# EAGLE design open-lux-Q (EAGLE 6.5.0)
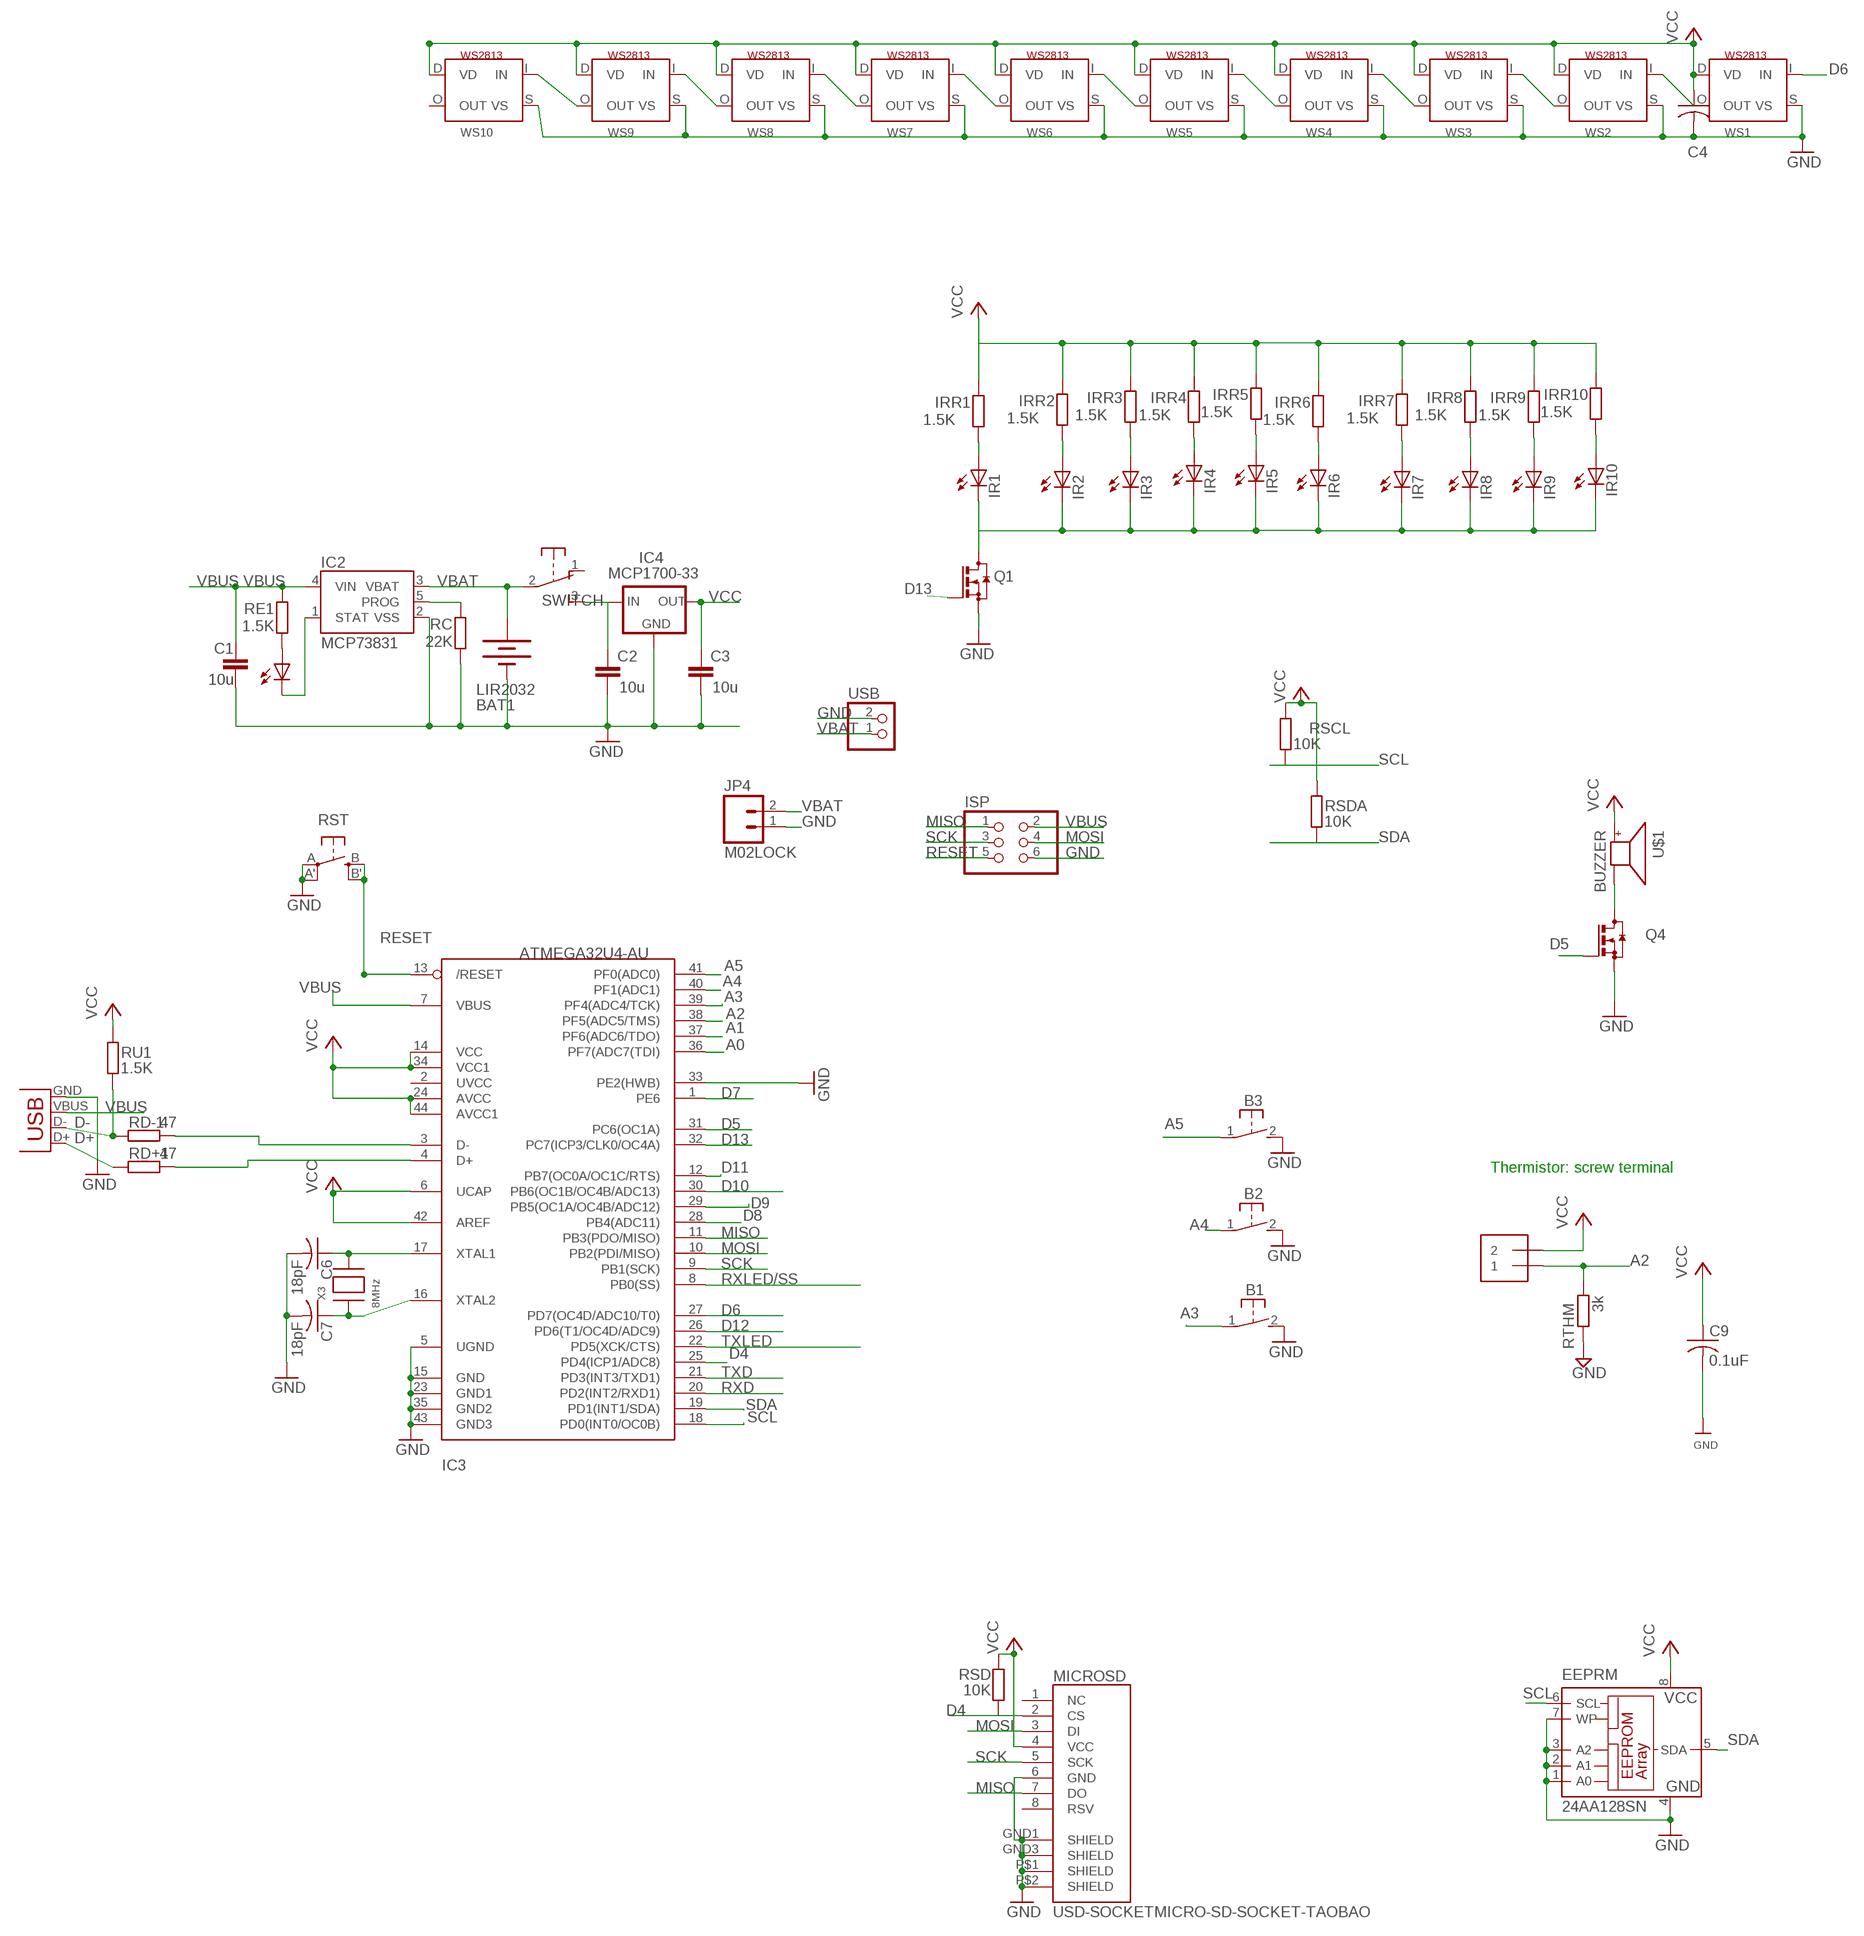
[diagram p0: schematic, sheet 1, part 1 of 2]
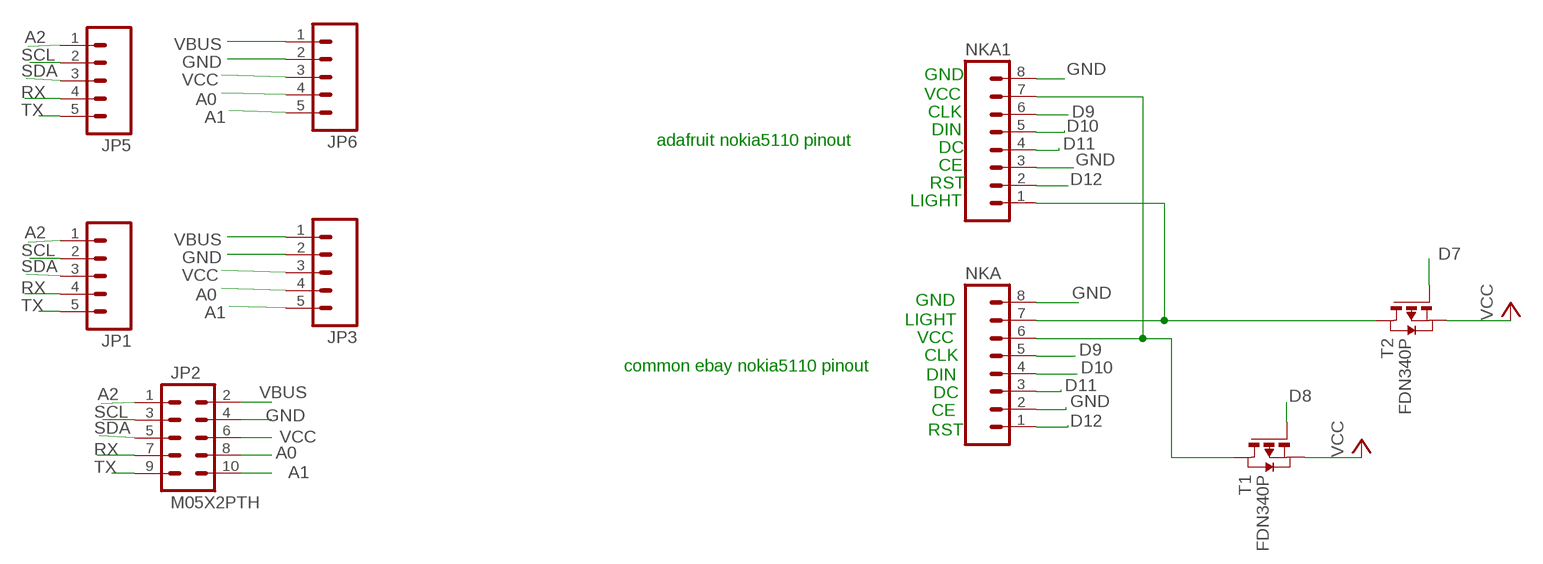
[diagram p1: schematic, sheet 1, part 2 of 2]

## Parts
B1  31-XX  [B3F-31XX]
B2  31-XX  [B3F-31XX]
B3  31-XX  [B3F-31XX]
BAT1  LIR2032  BATTERYBATTCOM_20MM_PTH_SMT  [BATTCOM_20MM_PTH_SMT]
C1  10u  C-EUC0805  [C0805]
C2  10u  C-EUC0805  [C0805]
C3  10u  C-EUC0805  [C0805]
C4  C-USC0805K  [C0805K]
C6  18pF  C-USC0805K  [C0805K]
C7  18pF  C-USC0805K  [C0805K]
C9  0.1uF  C-USC0805  [C0805]
EEPRM  24AA128SN  [SO-08]
IC2  MCP73831  [SOT23-5]
IC3  ATMEGA32U4-AU  [TQFP44]
IC4  MCP1700-33  MCP1700SOT233  [SOT23]
IR1  LEDCHIP-LED0603  [CHIP-LED0603]
IR2  LEDCHIP-LED0603  [CHIP-LED0603]
IR3  LEDCHIP-LED0603  [CHIP-LED0603]
IR4  LEDCHIP-LED0603  [CHIP-LED0603]
IR5  LEDCHIP-LED0603  [CHIP-LED0603]
IR6  LEDCHIP-LED0603  [CHIP-LED0603]
IR7  LEDCHIP-LED0603  [CHIP-LED0603]
IR8  LEDCHIP-LED0603  [CHIP-LED0603]
IR9  LEDCHIP-LED0603  [CHIP-LED0603]
IR10  LEDCHIP-LED0603  [CHIP-LED0603]
IRR1  1.5K  R-EU_R0805  [R0805]
IRR2  1.5K  R-EU_R0805  [R0805]
IRR3  1.5K  R-EU_R0805  [R0805]
IRR4  1.5K  R-EU_R0805  [R0805]
IRR5  1.5K  R-EU_R0805  [R0805]
IRR6  1.5K  R-EU_R0805  [R0805]
IRR7  1.5K  R-EU_R0805  [R0805]
IRR8  1.5K  R-EU_R0805  [R0805]
IRR9  1.5K  R-EU_R0805  [R0805]
IRR10  1.5K  R-EU_R0805  [R0805]
ISP  PINHD-2X3  [2X03]
JP1  M05LOCK  [1X05_LOCK]
JP2  M05X2PTH  [AVR_ICSP]
JP3  M05LOCK  [1X05_LOCK]
JP4  M02LOCK  [1X02_LOCK]
JP5  M05LOCK  [1X05_LOCK]
JP6  M05LOCK  [1X05_LOCK]
MICROSD  USD-SOCKETMICRO-SD-SOCKET-TAOBAO  [MICRO-SD-SOCKET-TAOBAO]
NKA  M08LOCK  [1X08_LOCK]
NKA1  M08LOCK  [1X08_LOCK]
PWR  0805  LEDCHIPLED_0805  [CHIPLED_0805]
Q1  BSS123  [SOT23]
Q4  BSS123  [SOT23]
RC  22K  R-EU_R0805  [R0805]
RD+1  47  R-EU_R0805  [R0805]
RD-1  47  R-EU_R0805  [R0805]
RE1  1.5K  R-EU_R0805  [R0805]
RSCL  10K  R-EU_R0805  [R0805]
RSD  10K  R-EU_R0805  [R0805]
RSDA  10K  R-EU_R0805  [R0805]
RST  EVQQ2  [EVQ-Q2]
RTHM  3k  R-EU_0204/7  [0204/7]
RU1  1.5K  R-EU_R0805  [R0805]
SWITCH  EG1206  [EG1206]
T1  FDN340P  PMOSSOT23  [SOT-23]
T2  FDN340P  PMOSSOT23  [SOT-23]
THM1  1X2-3.5MM  [1X2-3.5MM]
U$1  BUZZER  [SMT-8585-BUZZER]
USB  JST_2PIN-SMT-RA  [JST-PH-2-SMT-RA]
WS1  WS2813  [RGBLED5050_4]
WS2  WS2813  [RGBLED5050_4]
WS3  WS2813  [RGBLED5050_4]
WS4  WS2813  [RGBLED5050_4]
WS5  WS2813  [RGBLED5050_4]
WS6  WS2813  [RGBLED5050_4]
WS7  WS2813  [RGBLED5050_4]
WS8  WS2813  [RGBLED5050_4]
WS9  WS2813  [RGBLED5050_4]
WS10  WS2813  [RGBLED5050_4]
X2  USBSMD  [USB-MINIB]
X3  8MHz  XTALNX5032  [NX5032]

## Nets
A0: IC3.36(PF7(ADC7(TDI)) JP2.8 JP3.4 JP6.4
A1: IC3.37(PF6(ADC6/TDO)) JP2.10 JP3.5 JP6.5
A2: IC3.38(PF5(ADC5/TMS)) JP1.1 JP2.1 JP5.1 RTHM.2 THM1.1
A3: B1.1(P) IC3.39(PF4(ADC4/TCK))
A4: B2.1(P) IC3.40(PF1(ADC1))
A5: B3.1(P) IC3.41(PF0(ADC0))
D4: IC3.25(PD4(ICP1/ADC8)) MICROSD.2(CS) RSD.1
D5: IC3.31(PC6(OC1A)) Q4.1(G)
D6: IC3.27(PD7(OC4D/ADC10/T0)) WS1.I(IN)
D7: IC3.1(PE6) T2.3(G)
D8: IC3.28(PB4(ADC11)) T1.3(G)
D9: IC3.29(PB5(OC1A/OC4B/ADC12)) NKA1.6 NKA.5
D10: IC3.30(PB6(OC1B/OC4B/ADC13)) NKA1.5 NKA.4
D11: IC3.12(PB7(OC0A/OC1C/RTS)) NKA1.4 NKA.3
D12: IC3.26(PD6(T1/OC4D/ADC9)) NKA1.2 NKA.1
D13: IC3.32(PC7(ICP3/CLK0/OC4A)) Q1.1(G)
D+: RD+1.1 X2.D+
D-: RD-1.1 RU1.1 X2.D-
GND: B1.2(S) B2.2(S) B3.2(S) BAT1.P$1(-) C1.2 C2.2 C3.2 C4.2 C6.2 C7.2 C9.2 EEPRM.1(A0) EEPRM.2(A1) EEPRM.3(A2) EEPRM.4(GND) EEPRM.7(WP) IC2.2(VSS) IC3.5(UGND) IC3.15(GND) IC3.23(GND1) IC3.33(PE2(HWB)) IC3.35(GND2) IC3.43(GND3) IC4.1(GND) ISP.6 JP2.4 JP3.2 JP4.1 JP6.2 MICROSD.6(GND) MICROSD.GND1(SHIELD) MICROSD.GND3(SHIELD) MICROSD.P$1(SHIELD) MICROSD.P$2(SHIELD) NKA1.3 NKA1.8 NKA.2 NKA.8 Q1.2(S) Q4.2(S) RC.1 RST.A'(P1) RST.A(P) RTHM.1 USB.2 WS1.S(VS) WS2.S(VS) WS3.S(VS) WS4.S(VS) WS5.S(VS) WS6.S(VS) WS7.S(VS) WS8.S(VS) WS9.S(VS) WS10.S(VS) X2.GND
MISO: IC3.11(PB3(PDO/MISO)) ISP.1 MICROSD.7(DO)
MOSI: IC3.10(PB2(PDI/MISO)) ISP.4 MICROSD.3(DI)
N$1: C2.1 IC4.3(IN) SWITCH.3(S)
N$2: C7.1 IC3.16(XTAL2) X3.P$1
N$3: C6.1 IC3.17(XTAL1) X3.P$2
N$4: WS9.O(OUT) WS10.I(IN)
N$5: IC2.1(STAT) PWR.C
N$6: IC2.5(PROG) RC.2
N$7: Q4.3(D) U$1.-
N$8: IR1.C IR2.C IR3.C IR4.C IR5.C IR6.C IR7.C IR8.C IR9.C IR10.C Q1.3(D)
N$9: T2.1(D)
N$10: PWR.A RE1.1
N$11: IR1.A IRR1.1
N$12: NKA1.1 NKA.7
N$13: IR2.A IRR2.1
N$14: WS6.O(OUT) WS7.I(IN)
N$15: IR3.A IRR3.1
N$16: IR6.A IRR6.1
N$17: IR4.A IRR4.1
N$18: IR5.A IRR5.1
N$19: WS4.O(OUT) WS5.I(IN)
N$20: WS5.O(OUT) WS6.I(IN)
N$21: IC3.4(D+) RD+1.2
N$22: IC3.3(D-) RD-1.2
N$23: WS1.O(OUT) WS2.I(IN)
N$24: WS2.O(OUT) WS3.I(IN)
N$25: WS3.O(OUT) WS4.I(IN)
N$26: IR7.A IRR7.1
N$27: WS8.O(OUT) WS9.I(IN)
N$28: WS7.O(OUT) WS8.I(IN)
N$29: IR8.A IRR8.1
N$30: IR9.A IRR9.1
N$31: NKA1.7 NKA.6 T1.1(D)
N$32: IR10.A IRR10.1
RESET: IC3.13(/RESET) ISP.5 RST.B'(S1) RST.B(S)
RX: JP1.4 JP2.7 JP5.4
RXD: IC3.20(PD2(INT2/RXD1))
RXLED/SS: IC3.8(PB0(SS))
SCK: IC3.9(PB1(SCK)) ISP.3 MICROSD.5(SCK)
SCL: EEPRM.6(SCL) IC3.18(PD0(INT0/OC0B)) JP1.2 JP2.3 JP5.2 RSCL.1
SDA: EEPRM.5(SDA) IC3.19(PD1(INT1/SDA)) JP1.3 JP2.5 JP5.3 RSDA.1
TX: JP1.5 JP2.9 JP5.5
TXD: IC3.21(PD3(INT3/TXD1))
TXLED: IC3.22(PD5(XCK/CTS))
VBAT: BAT1.P$2(+) IC2.3(VBAT) JP4.2 SWITCH.2(P) USB.1
VBUS: C1.1 IC2.4(VIN) IC3.7(VBUS) ISP.2 JP2.2 JP3.1 JP6.1 RE1.2 X2.VBUS
VCC: C3.1 C4.1 C9.1 EEPRM.8(VCC) IC3.6(UCAP) IC3.14(VCC) IC3.24(AVCC) IC3.34(VCC1) IC3.42(AREF) IC3.44(AVCC1) IC4.2(OUT) IRR1.2 IRR2.2 IRR3.2 IRR4.2 IRR5.2 IRR6.2 IRR7.2 IRR8.2 IRR9.2 IRR10.2 JP2.6 JP3.3 JP6.3 MICROSD.4(VCC) RSCL.2 RSD.2 RSDA.2 RU1.2 T1.2(S) T2.2(S) THM1.2 U$1.+ WS1.D(VD) WS2.D(VD) WS3.D(VD) WS4.D(VD) WS5.D(VD) WS6.D(VD) WS7.D(VD) WS8.D(VD) WS9.D(VD) WS10.D(VD)
Unconnected: IC3.2(UVCC) MICROSD.1(NC) MICROSD.8(RSV) SWITCH.1(O) WS10.O(OUT)

## Notes on the sheet
- GND
- VCC
- CLK
- adafruit nokia5110 pinout | DIN
- DC
- CE
- RST
- LIGHT
- GND
- LIGHT
- VCC
- common ebay nokia5110 pinout | CLK
- DIN
- DC
- CE
- RST
- Thermistor: screw terminal

## Library data of the parts
B1-B3 = adafruit:31-XX: OMRON SWITCH Now with beefier pads!
BAT1 = SparkFunNew:BATTERY: Battery Holders Various common sizes : AA, AAA, 20mm coin cell and 12mm coin cell.
C1-C3 = resistor:C-EU: CAPACITOR, European symbol
C4 = adafruit2013:C-US: CAPACITOR, American symbol
C6 C7 C9 = adafruit:C-US: CAPACITOR, American symbol
EEPRM = microchip:24*: Serial EEPROM I2C; MF: MICROCHIP; MPN: 24AA128-I/SN; OC_FARNELL: unknown; OC_NEWARK: 92C6842
IC2 = SparkFunNew:MCP73831: Microchip's MCP73831 Miniature single cell, fully integrated Li-Ion, Li-polymer charge management controller http://ww1.microchip.com/downloads/en/DeviceDoc/21984a.pdf
IC3 = adaprog:ATMEGA32U4
IC4 = adafruit:MCP1700: VOLTAGE REGULATOR
IR1-IR10 = adafruit:LED: LED
IRR1-IRR10 RC RD+1 RD-1 RE1 RSCL RSD RSDA RTHM RU1 = rcl:R-EU_: RESISTOR, European symbol
ISP = pinhead:PINHD-2X3: PIN HEADER
JP1 JP3 JP5 JP6 = SparkFun-Connectors:M05: Header 5 Standard 5-pin 0.1" header. Use with straight break away headers (SKU : PRT-00116), right angle break away headers (PRT-00553), swiss pins (PRT-00743), machine pins (PRT-00117), and female headers (PRT-00115). Molex polarized connector foot print use with SKU : PRT-08230 with associated crimp pins and housings.
JP2 = SparkFun-Connectors:M05X2: Header 5x2 Standard 10-pin dual row 0.1" header. Commonly used with AVR-ISP. Use with Spark Fun Electronics SKU: PRT-00778
JP4 = SparkFun-Connectors:M02: Standard 2-pin 0.1" header. Use with - straight break away headers ( PRT-00116) - right angle break away headers (PRT-00553) - swiss pins (PRT-00743) - machine pins (PRT-00117) - female headers (PRT-00115) Molex polarized connector foot print use with: PRT-08233 with associated crimp pins and housings. 2.54_SCREWTERM for use with PRT-10571. 3.5mm Screw Terminal footprints for PRT-08084 5mm Screw Terminal footprints for use with PRT-08433
MICROSD = SparkFunNew:USD-SOCKET: microSD Socket Push-push type uSD socket. Schematic element and footprint production proven. Spark Fun Electronics SKU : PRT-00127. tDoc lines correctly indicate media card edge positions when inserting (unlocked, locked, depressed).
NKA NKA1 = SparkFun-Connectors:M08: Header 8 Standard 8-pin 0.1" header. Use with straight break away headers (SKU : PRT-00116), right angle break away headers (PRT-00553), swiss pins (PRT-00743), machine pins (PRT-00117), and female headers (PRT-00115).
PWR = led:LED: LED
Q1 Q4 = transistor-small-signal:BSS123: N-CHANNEL MOS FET
RST = adafruit:EVQQ2: SMT 6mm switch, EVQQ2 series http://www.ladyada.net/library/eagle
SWITCH = adafruit:EG1206
T1 T2 = zetex:PMOSSOT23: MOS FET
THM1 = adafruit:1X2: 3.5mm Terminal block http://www.ladyada.net/library/pcb/eaglelibrary.html
U$1 = adafruit:BUZZER
USB = adafruit:JST_2PIN: JST 2-Pin Connectors of various flavors SMT-RA (S2B-PH-SM4) 4UConnector #17311 SMT (B2B-PH-SM4) THM-RA (S2B-PH) THM (B2B-PH)
WS1-WS10 = adafruit:WS2813
X2 = SparkFun:USB: USB Connectors USB-B-PTH is fully proven SKU : PRT-00139 USB-miniB is fully proven SKU : PRT-00587 USB-A-PCB is untested. USB-A-H is throughly reviewed, but untested. Spark Fun Electronics SKU : PRT-00437 USB-B-SMT is throughly reviewed, but untested. Needs silkscreen touching up. USB-A-S has not been used/tested USB-MB-H has not been used/tested
X3 = adaprog:XTAL

## Net classes
1 power: width 0.813 mm, clearance 0.203 mm

## Board
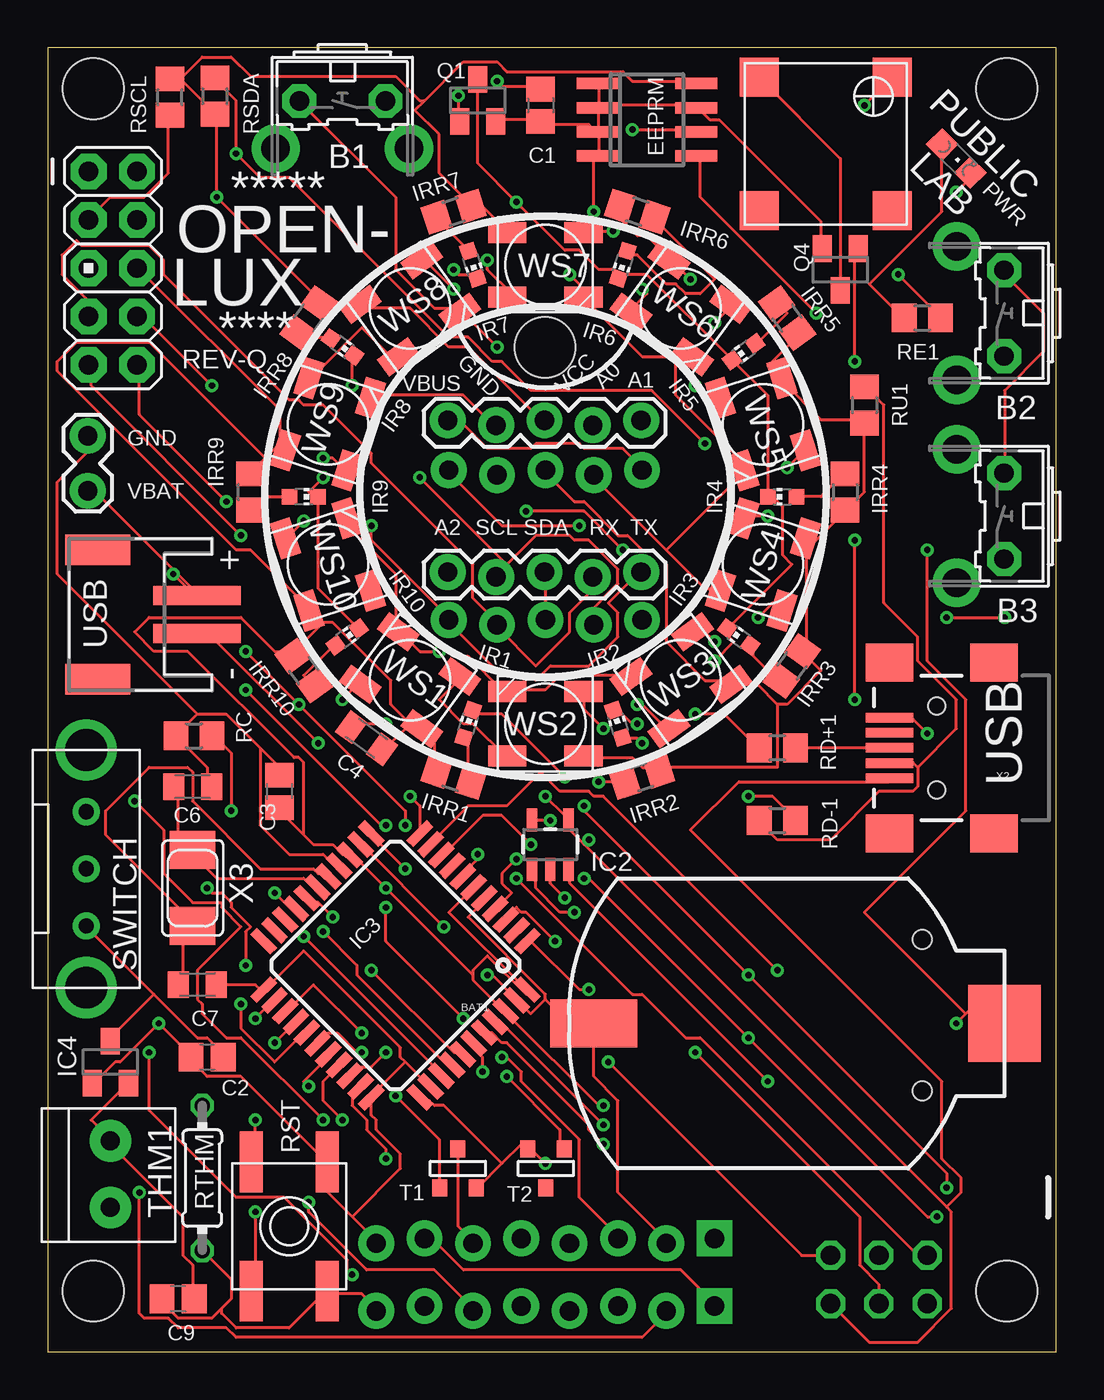
[diagram p2: board, top side]
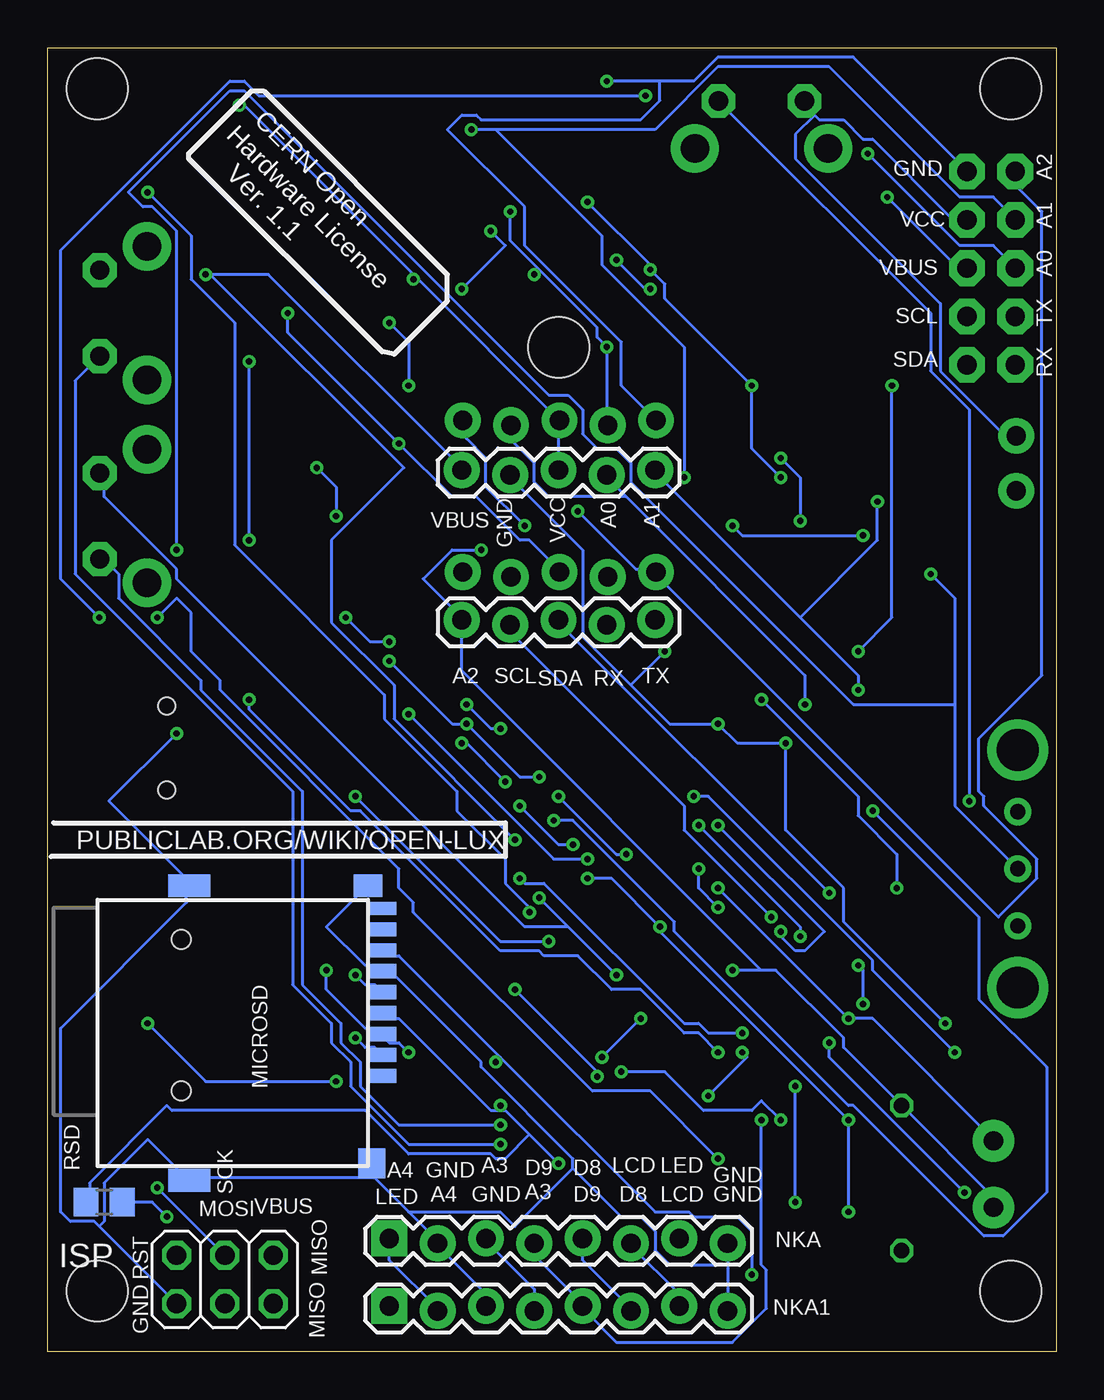
[diagram p3: board, bottom side, seen from below]

Size 53.01 x 68.57 mm. Coordinates in mm from the lower left corner, seen from the top.
Outline: 0,0 53.01,0 53.01,68.57 0,68.57 0,0
Copper layers (1*16): Top 0.0356mm / dielectric 1.5011mm / Bottom 0.0356mm
Design rules "LaenPCBOrder": minimum track width 6mil, minimum drill 13mil, track to track 6mil, track to pad 6mil, pad to pad 6mil, via to via 6mil, smd to smd 6mil, copper to edge 15mil, drill to drill 6mil, minimum pad ring 7mil, minimum via ring 7mil, stop-mask expansion 3mil, vias tented up to drill 0mil, thermal gap 10mil
Holes 3.2 mm at 2.4,66.4 50.4,3.2 50.4,66.4 2.4,3.2 26.14,52.81

### Footprints (pad centres in the part's own frame; a part is rotated, then mirrored left to right if it is on the bottom)
B3F-31XX = drill 1.016 pad 1.778 octagon: 1 -2.261,-1.245; 2 2.261,-1.245 | drill 1.499 pad 2.54: 3 -3.505,1.245; 4 3.505,1.245
BATTCOM_20MM_PTH_SMT = smd 4.572 x 2.54: P$1 0,0 | smd 3.81 x 4.064: P$2 21.59,0
C0805 = smd 1.3 x 1.5: 1 -0.85,0; 2 0.85,0
C0805K = smd 1.1 x 1.4: 1 -1,0; 2 1,0
SO-08 = smd 0.6 x 2.2: 1 -1.905,-2.6; 2 -0.635,-2.6; 3 0.635,-2.6; 4 1.905,-2.6; 5 1.905,2.6; 6 0.635,2.6; 7 -0.635,2.6; 8 -1.905,2.6
SOT23-5 = smd 0.55 x 1.2: 1 -0.95,-1.3; 2 0,-1.3; 3 0.95,-1.3; 4 0.95,1.3; 5 -0.95,1.3
TQFP44 = smd 1.5 x 0.5: 1 -5.8,4; 2 -5.8,3.2; 3 -5.8,2.4; 4 -5.8,1.6; 5 -5.8,0.8; 6 -5.8,0; 7 -5.8,-0.8; 8 -5.8,-1.6; 9 -5.8,-2.4; 10 -5.8,-3.2; 11 -5.8,-4; 23 5.8,-4; 24 5.8,-3.2; 25 5.8,-2.4; 26 5.8,-1.6; 27 5.8,-0.8; 28 5.8,0; 29 5.8,0.8; 30 5.8,1.6; 31 5.8,2.4; 32 5.8,3.2; 33 5.8,4 | smd 0.5 x 1.5: 12 -4,-5.8; 13 -3.2,-5.8; 14 -2.4,-5.8; 15 -1.6,-5.8; 16 -0.8,-5.8; 17 0,-5.8; 18 0.8,-5.8; 19 1.6,-5.8; 20 2.4,-5.8; 21 3.2,-5.8; 22 4,-5.8; 34 4,5.8; 35 3.2,5.8; 36 2.4,5.8; 37 1.6,5.8; 38 0.8,5.8; 39 0,5.8; 40 -0.8,5.8; 41 -1.6,5.8; 42 -2.4,5.8; 43 -3.2,5.8; 44 -4,5.8
SOT23 = smd 1 x 1.4: 1 -0.95,-1.1; 2 0.95,-1.1; 3 0,1.1
CHIP-LED0603 = smd 0.8 x 0.8: A 0,-0.75; C 0,0.75
R0805 = smd 1.3 x 1.5: 1 -0.95,0; 2 0.95,0
2X03 = drill 1.016 octagon: 1 -2.54,-1.27; 2 -2.54,1.27; 3 0,-1.27; 4 0,1.27; 5 2.54,-1.27; 6 2.54,1.27
1X05_LOCK = drill 1.016 pad 1.88: 1 0,0.127; 2 2.54,-0.127; 3 5.08,0.127; 4 7.62,-0.127; 5 10.16,0.127
AVR_ICSP = drill 1.016 pad 1.88 octagon: 1 -1.27,5.08; 2 1.27,5.08; 3 -1.27,2.54; 4 1.27,2.54; 5 -1.27,0; 6 1.27,0; 7 -1.27,-2.54; 8 1.27,-2.54; 9 -1.27,-5.08; 10 1.27,-5.08
1X02_LOCK = drill 1.016 pad 1.88: 1 -0.178,0; 2 2.718,0
MICRO-SD-SOCKET-TAOBAO = smd 0.75 x 1.6: 1 2.25,10.5; 2 1.15,10.5; 3 0.05,10.5; 4 -1.05,10.5; 5 -2.15,10.5; 6 -3.25,10.5; 7 -4.35,10.5; 8 -5.45,10.5 | smd 0.7 x 1.6: CD -6.55,10.5 | smd 1.2 x 1.5: GND1 -7.75,9.8 | smd 1.6 x 1.4: GND3 6.85,10 | smd 1.2 x 2.2: P$1 7.75,0.4; P$2 -7.75,0.4 | hole 1: 3.05,0; -4.93,0
1X08_LOCK = drill 1.016 pad 1.88 square: 1 0,0.127 | drill 1.016 pad 1.88: 2 2.54,-0.127; 3 5.08,0.127; 4 7.62,-0.127; 5 10.16,0.127; 6 12.7,-0.127; 7 15.24,0.127; 8 17.78,-0.127
CHIPLED_0805 = smd 1.2 x 1.2: A 0,-1.05; C 0,1.05
EVQ-Q2 = smd 3.2 x 1.2: A -3.4,-2; A' 3.4,-2; B -3.4,2; B' 3.4,2
0204/7 = drill 0.813 octagon: 1 -3.81,0; 2 3.81,0
EG1206 = drill 0.8 pad 1.422: 1 -3,0; 2 0,0; 3 3,0 | drill 2.2: MT1 -6.25,0; MT2 6.25,0
SOT-23 = smd 0.787 x 0.889: 1 0.025,-1.016; 2 -0.94,1.016; 3 0.991,1.016
1X2-3.5MM = drill 1 pad 2.184: 1 1.8,0; 2 -1.7,0
SMT-8585-BUZZER = smd 2.05 x 2.05: + -3.5,-3.5; - 3.5,-3.5; NC1 -3.5,3.5; NC2 3.5,3.5
JST-PH-2-SMT-RA = smd 1 x 4.6: 1 1,-3.7; 2 -1,-3.7 | smd 1.6 x 3.4: NC1 -3.4,1.5; NC2 3.4,1.5
RGBLED5050_4 = smd 2 x 1.1: D -2,1.7; I 2,1.7; O -2,-1.7; S 2,-1.7
USB-MINIB = smd 2.5 x 0.5: D+ 2.5,0; D- 2.5,0.8; GND 2.5,-1.6; ID 2.5,-0.8; VBUS 2.5,1.6 | smd 2.5 x 2: GND@1 -3,-4.5; GND@2 -3,4.5; GND@3 2.5,4.5; GND@4 2.5,-4.5 | hole 0.9: 0,2.2; 0,-2.2
NX5032 = smd 2 x 2.4: P$1 2,0; P$2 -2,0

### Placement (x,y rotation side)
B1  15.49,64.52 180 top
B2  49.02,54.61 90 top
B3  49.02,43.94 90 top
BAT1  28.7,17.27 0 top
C1  25.91,65.53 270 top
C2  8.38,15.49 180 top
C3  12.19,29.46 90 top
C4  16.76,32.26 144 top
C6  7.62,29.72 0 top
C7  7.87,19.3 0 top
C9  6.86,2.79 180 top
EEPRM  31.5,64.77 270 top
IC2  26.42,26.67 0 top
IC3  18.29,20.32 225 top
IC4  3.3,15.24 0 top
IR1  22.1,33.02 342 top
IR2  29.97,33.02 18 top
IR3  36.32,37.59 54 top
IR4  38.61,44.96 90 top
IR5  36.58,52.58 126 top
IR6  30.23,57.15 162 top
IR7  22.35,57.15 198 top
IR8  15.49,52.83 234 top
IR9  13.46,44.96 270 top
IR10  15.75,37.59 306 top
IRR1  21.34,30.23 162 top
IRR2  31.24,30.23 18 top
IRR3  39.12,36.07 54 top
IRR4  41.91,45.21 270 top
IRR5  38.86,54.36 306 top
IRR6  30.99,59.94 162 top
IRR7  21.34,59.94 18 top
IRR8  13.72,54.36 54 top
IRR9  10.67,45.21 90 top
IRR10  13.46,35.81 126 top
ISP  43.69,3.81 180 bottom
JP1  21.03,40.87 0 top
JP2  3.43,56.97 0 top
JP3  21.03,48.84 0 top
JP4  2.11,47.98 270 top
JP5  31.24,38.35 0 bottom
JP6  31.24,46.23 0 bottom
MICROSD  45.97,16.76 270 bottom
NKA  35.05,5.84 0 bottom
NKA1  35.05,2.29 0 bottom
PWR  47.75,62.74 225 top
Q1  22.61,65.79 0 top
Q4  41.66,56.9 180 top
RC  7.7,32.38 0 top
RD+1  38.35,31.75 180 top
RD-1  38.35,27.94 0 top
RE1  45.97,54.36 0 top
RSCL  6.43,65.96 90 top
RSD  50.04,7.87 180 bottom
RSDA  8.79,66.01 270 top
RST  12.7,6.6 90 top
RTHM  8.13,9.14 90 top
RU1  42.93,49.78 270 top
SWITCH  2.03,25.4 270 top
T1  21.59,9.65 180 top
T2  26.16,9.65 0 top
THM1  3.3,9.4 270 top
U$1  40.89,63.5 180 top
USB  4.14,38.76 90 top
WS1  19.05,35.31 144 top
WS2  26.16,33.02 180 top
WS3  33.27,35.31 216 top
WS4  37.59,41.4 252 top
WS5  37.59,48.77 288 top
WS6  33.27,54.86 324 top
WS7  26.16,57.15 0 top
WS8  19.05,54.86 36 top
WS9  14.73,48.77 72 top
WS10  14.73,41.4 108 top
X2  46.74,31.75 180 top
X3  7.62,24.38 270 top

### Tracks (layer width: path | path; a pad name or v marks a point on that pad's centre or on a via)
A0  (via drill 0.33)
  Top 0.152: v13.46,21.84 20.57,14.73 IC3.36 | v18.8,27.69 18.8,28.45 v13.21,34.04 v10.41,36.83 | v8.64,50.8 5.08,54.36 4.83,54.36 JP2.8
  Bottom 0.152: v13.46,21.84 13.46,22.35 v18.8,27.69 | v13.21,34.04 13.21,35.56 22.61,44.96 | 22.61,44.96 23.62,45.97 JP6.4 | v8.64,50.8 8.64,38.61 v10.41,36.83 | 22.61,44.96 26.67,44.96 27.43,45.72 27.43,46.74 28.45,47.75 28.45,48.51 JP3.4
A1  (via drill 0.33)
  Top 0.152: v14.48,22.1 16.26,20.32 16.26,19.81 20.83,15.24 21.08,15.24 IC3.37 | v17.78,27.69 17.53,27.69 v10.41,34.8 | v9.4,44.7 4.83,49.28 4.83,51.82 JP2.10 | v27.94,43.43 23.88,43.43 21.08,46.23 JP6.5
  Bottom 0.152: v14.48,22.1 14.48,21.84 13.72,21.08 13.21,21.08 12.19,22.1 v17.78,27.69 | v10.41,34.8 10.41,35.56 13.46,38.61 | 13.46,38.61 21.08,46.23 JP6.5 | v9.4,44.7 9.4,42.67 13.46,38.61 | v27.94,43.43 29.97,45.47 29.97,46.99 30.99,48.01 30.99,48.77 JP3.5
A2  (via drill 0.33)
  Top 0.152: v17.02,20.07 21.34,15.75 21.59,15.75 IC3.38 | v25.15,44.2 28.19,44.2 v30.23,42.16
  Bottom 0.152: 15.49,20.07 14.73,20.07 11.18,16.51 11.18,16 RTHM.2 3.3,8.13 THM1.1 | 15.49,20.07 v17.02,20.07 | 15.49,20.07 31.24,35.81 JP5.1 31.24,38.61 33.27,40.64 31.75,42.16 v30.23,42.16 | v25.15,44.2 22.1,41.15 21.08,41.15 JP1.1 21.08,40.89 3.05,22.86 1.02,24.89 1.02,25.91 3.81,28.7 3.81,29.21 4.06,29.46 4.06,32.26 0.76,35.56 0.76,59.94 2.03,61.21 2.03,61.98 JP2.1
A3  (via drill 0.33)
  Top 0.152: v22.86,14.73 22.86,15.49 22.61,15.75 22.61,16 IC3.39 | v14.48,12.19 10.16,16.51 9.4,16.51 8.13,17.78 8.13,18.29 7.87,18.54 7.87,20.07 10.16,22.35 9.14,23.37 9.14,23.62 7.62,23.62 6.1,25.15 6.1,27.43 v4.57,28.96
  Bottom 0.152: v22.86,14.73 20.57,14.73 18.54,12.7 16,12.7 15.49,13.21 v14.48,12.19 | v4.57,28.96 4.57,49.53 6.6,51.56 6.6,54.61 B1.1
A4  (via drill 0.33)
  Top 0.152: v29.21,10.92 28.45,11.68 28.45,11.94 24.13,16.26 23.88,16.26 23.37,16.76 23.11,16.76 IC3.40
  Bottom 0.152: v29.21,10.92 34.04,10.92 37.08,13.97 37.08,15.24 38.1,16.26 38.1,17.27 40.13,19.3 40.13,29.46 51.56,40.89 51.56,51.05 B2.1
A5  (via drill 0.33)
  Top 0.152: v29.21,11.94 23.88,17.27 23.62,17.27 IC3.41
  Bottom 0.152: v29.21,11.94 34.54,11.94 36.58,13.97 36.58,15.24 37.59,16.26 37.59,17.27 39.62,19.3 39.62,29.46 44.96,34.8 44.96,35.31 49.28,39.62 49.28,40.89 50.04,41.66 B3.1
D4  (via drill 0.33)
  Top 0.152: v16.51,16.76 13.97,19.3 12.7,18.03 IC3.25 | v28.19,24.89 28.45,24.89 v36.83,16.51 46.23,7.11 v46.74,7.11
  Bottom 0.152: v16.51,16.76 18.29,16.76 18.8,17.27 19.56,17.27 26.92,24.64 27.94,24.64 v28.19,24.89 | v36.83,16.51 36.32,16 35.81,16 35.56,15.75 MICROSD.2 | RSD.1 47.5,7.87 v46.74,7.11
D5  (via drill 0.33)
  Top 0.152: v42.42,52.07 42.42,57.91 Q4.1 | v42.42,34.29 v42.42,42.67 | v17.78,15.75 17.02,14.99 16.26,14.99 16,14.73 IC3.31
  Bottom 0.152: v42.42,42.67 v42.42,52.07 | v42.42,34.29 42.42,33.78 37.08,28.45 36.58,28.45 29.21,21.08 27.18,21.08 26.92,20.83 25.15,20.83 23.37,19.05 21.84,19.05 19.56,16.76 18.8,16.76 v17.78,15.75
D6  (via drill 0.33)
  Top 0.152: v10.16,18.29 10.16,17.02 11.94,15.24 13.46,16.76 IC3.27 | v10.41,20.32 10.41,22.1 10.67,22.35 9.65,23.37 9.65,23.62 9.14,24.13 8.64,24.13 v8.38,24.38 | v15.49,34.29 16.26,35.05 WS1.I
  Bottom 0.152: v10.16,18.29 10.16,20.07 v10.41,20.32 | v8.38,24.38 8.38,26.16 10.41,28.19 10.41,29.21 v15.49,34.29
D7  (via drill 0.33)
  Top 0.152: v24.13,14.48 26.92,11.68 26.92,10.67 T2.3 | v28.45,19.05 27.94,19.05 25.4,21.59 IC3.1
  Bottom 0.152: v24.13,14.48 24.13,14.73 v28.45,19.05
D8  (via drill 0.33)
  Top 0.152: v18.29,13.46 20.57,11.18 20.57,8.64 T1.3 | v16.51,15.75 16.26,15.75 15.24,16.76 14.73,16.76 IC3.28
  Bottom 0.152: v18.29,13.46 16.26,15.49 v16.51,15.75
D9  (via drill 0.33)
  Top 0.152: v13.72,13.97 13.46,14.22 14.73,15.49 IC3.29 | v13.72,7.87 13.72,7.37 16.76,4.32 20.32,4.32 22.35,2.29 NKA1.6
  Bottom 0.152: v13.72,7.87 v13.72,13.97 | NKA.5 24.89,4.83 22.35,2.29 NKA1.6
D10  (via drill 0.33)
  Top 0.152: v15.49,12.19 14.48,13.21 14.48,14.22 15.24,14.99 IC3.30
  Bottom 0.152: v15.49,12.19 15.49,4.57 15.24,4.32 15.24,2.29 17.02,0.51 23.11,0.51 24.89,2.29 NKA1.5 24.89,2.54 27.43,5.08 NKA.4
D11  (via drill 0.33)
  Top 0.152: v18.8,25.4 17.02,27.18 IC3.12 | v17.78,23.37 17.78,21.59 v21.84,17.53 | v23.88,15.49 24.13,15.49 24.89,14.73 24.89,14.22 27.94,11.18 27.94,8.13 29.97,6.1 NKA.3
  Bottom 0.152: v18.8,25.4 18.8,24.38 v17.78,23.37 | v23.88,15.49 v21.84,17.53 | NKA1.4 27.43,3.3 29.97,5.84 NKA.3
D12  (via drill 0.33)
  Top 0.152: v11.94,16.26 12.95,17.27 IC3.26 | v4.83,8.38 4.83,2.03 5.08,1.78 6.35,1.78 6.86,1.27 9.4,1.27 9.91,0.76 31.24,0.76 32.51,2.03 NKA1.2
  Bottom 0.152: v11.94,16.26 11.94,15.49 v4.83,8.38 | NKA.1 35.05,4.83 32.51,2.29 NKA1.2
D13  (via drill 0.33)
  Top 0.152: v21.59,66.04 21.59,64.77 Q1.1 | v47.24,38.61 v50.29,38.61 | v17.78,10.16 17.78,10.67 16.76,11.68 16.76,12.19 16,12.95 16,13.46 16.26,13.72 IC3.32
  Bottom 0.152: v21.59,66.04 41.91,66.04 42.67,66.8 43.43,66.8 52.32,57.91 52.32,40.64 v50.29,38.61 | v47.24,38.61 46.23,39.62 45.47,38.86 45.47,36.83 43.94,35.31 43.94,34.8 34.54,25.4 34.54,24.38 33.78,23.62 33.78,23.11 24.38,13.72 21.34,13.72 v17.78,10.16
D+
  Top 0.152: X2.D+ RD+1.1
D-
  Top 0.152: 45.72,30.73 45.72,29.72 45.47,29.46 43.69,29.46 41.15,26.92 38.35,26.92 37.59,27.69 37.59,27.94 RD-1.1 | 45.72,30.73 45.47,30.99 44.45,30.99 X2.D- | 45.72,30.73 47.75,32.77 47.75,34.29 45.72,36.32 45.72,37.59 43.94,39.37 43.94,49.78 43.18,50.55 42.93,50.55 RU1.1
GND  (via drill 0.33)
  Top 0.152: WS3.S 30.48,35.56 26.92,35.56 26.16,34.8 24.38,34.8 WS2.S 24.13,34.8 23.88,34.8 22.1,36.58 21.59,36.58 21.34,36.83 v20.57,36.83 19.56,36.83 18.54,37.85 WS1.S 18.29,38.1 18.29,40.89 15.49,43.69 WS10.S | 33.02,52.32 31.24,52.32 28.19,55.37 WS7.S 27.94,55.63 27.94,56.13 v27.43,56.64 | 33.02,52.32 33.78,52.32 WS6.S 33.02,52.32 | v17.78,33.02 16,33.02 C4.2 | 32.51,42.16 28.7,45.97 JP6.2 | 32.51,42.16 34.54,40.13 35.31,40.13 WS4.S | 32.51,42.16 36.58,46.23 WS5.S 36.83,46.48 33.02,50.29 33.02,52.32 | v14.22,32 8.64,37.59 7.87,37.59 USB.2 | C6.2 8.38,29.72 8.38,30.73 6.86,32.26 RC.1 6.86,32.51 7.87,33.53 | C3.2 12.19,30.73 11.18,31.75 | 11.18,31.75 9.4,33.53 7.87,33.53 | 11.18,31.75 11.18,27.69 12.7,26.16 14.48,26.16 14.99,25.65 15.24,25.65 IC3.15 | 7.87,33.53 0.51,40.89 0.51,45.72 2.03,47.24 2.03,48.01 JP4.1 | 28.96,65.53 28.96,66.55 EEPRM.1 | Q1.2 23.62,64.77 25.91,64.77 C1.2 25.91,64.52 28.45,64.52 28.7,64.26 EEPRM.3 | EEPRM.3 28.96,64.01 28.96,62.99 EEPRM.4 28.7,62.74 v28.7,59.94 | EEPRM.3 28.96,64.26 28.96,65.28 EEPRM.2 28.96,65.53 | Q4.2 40.64,58.17 40.64,59.44 35.31,64.77 34.8,64.77 34.29,65.28 EEPRM.7 34.04,65.53 28.96,65.53 | WS9.S 17.02,50.29 21.84,50.29 23.37,48.77 JP3.2 | B1.2 18.29,60.71 18.29,56.9 20.32,54.86 21.59,54.86 WS8.S 21.84,54.61 v23.62,52.83 | B3.2 50.29,46.23 50.29,50.55 52.32,52.58 52.32,54.61 50.29,56.64 B2.2 | IC2.2 26.42,24.64 v27.18,23.88 | v23.11,19.81 23.37,19.81 24.64,18.54 IC3.43 24.89,18.29 25.4,17.78 26.16,18.54 | 26.16,18.54 26.16,18.8 22.1,22.86 22.86,23.62 IC3.5 | 26.16,18.54 27.43,17.27 BAT1.P$1 28.7,14.48 29.97,13.21 29.97,8.38 32.51,5.84 NKA.2
  Top 0.152: v46.23,32.51 45.47,33.27 44.45,33.27 X2.GND | 9.14,2.29 9.65,2.79 9.65,3.81 RTHM.1 | 9.14,2.29 8.64,1.78 6.86,1.78 6.1,2.54 6.1,2.79 C9.2 | NKA1.8 17.27,2.29 16.51,3.05 14.73,3.05 RST.A 14.48,3.05 12.7,1.27 9.91,1.27 9.14,2.03 9.14,2.29 | C7.2 10.92,19.3 11.18,19.05 IC3.23 11.43,19.05 13.46,21.08 18.54,16 18.54,15.49 18.8,15.24 | 18.8,15.24 17.02,13.46 IC3.33 17.02,13.21 17.02,12.45 17.27,12.19 17.27,11.68 18.54,10.41 18.54,9.65 16,7.11 | 18.8,15.24 20.07,13.97 IC3.35 | 7.62,15.49 v5.84,17.27 3.81,15.24 3.56,15.24 2.54,14.22 IC4.1 | 16,7.11 17.27,5.84 NKA.8 | 16,7.11 14.73,8.38 14.73,9.91 RST.A' 14.48,10.16 10.16,14.48 8.38,14.48 7.62,15.24 7.62,15.49 | 7.62,15.49 C2.2
  Bottom 0.152: 22.35,35.05 24.89,37.59 24.89,42.16 28.7,45.97 JP6.2 | 22.35,35.05 20.32,33.02 v17.78,33.02 16.76,32 v14.22,32 14.22,27.43 11.18,24.38 11.18,22.61 v5.84,17.27 | 22.35,35.05 v20.57,36.83 | 12.7,65.02 13.21,65.53 B1.2 | 12.7,65.02 12.45,64.77 11.18,64.77 10.16,63.75 9.65,63.75 5.59,59.69 4.83,59.69 JP2.4 | JP3.2 23.62,48.77 v23.62,52.83 24.13,53.34 24.13,53.85 27.18,56.9 | v28.7,59.94 28.7,58.42 27.18,56.9 | 12.7,65.02 13.72,64.01 13.72,62.74 6.1,55.12 6.1,51.56 2.79,48.26 2.29,48.26 JP4.1 | 27.18,56.9 v27.43,56.64 | v23.11,19.81 25.65,22.35 | 25.65,22.35 v27.18,23.88 | 25.65,22.35 27.94,22.35 46.23,40.64 46.23,41.15 50.04,44.96 50.04,45.97 B3.2 | ISP.6 50.29,6.6 | 50.29,6.6 50.55,6.86 51.82,6.86 52.32,7.37 52.32,17.02 45.72,23.62 45.72,24.38 MICROSD.P$2 45.47,24.64 49.78,28.96 v46.23,32.51 | NKA.8 17.27,4.57 | 17.27,4.57 NKA1.8 | MICROSD.GND1 36.32,24.38 38.35,22.35 36.32,20.32 35.81,20.32 35.56,20.07 MICROSD.6 35.31,19.81 34.8,19.81 30.23,15.24 30.23,14.99 25.4,10.16 25.4,9.65 | 35.81,9.14 35.81,9.91 MICROSD.GND3 35.81,9.14 | 34.04,7.37 32.51,5.84 NKA.2 32.51,5.59 29.97,3.05 NKA1.3 | 34.04,7.37 35.81,9.14 | 35.81,9.14 45.47,9.14 MICROSD.P$1 45.72,9.14 47.75,11.18 50.04,8.89 50.04,6.86 50.29,6.6 | 25.4,9.65 28.45,6.6 29.21,7.37 34.04,7.37 | 17.27,4.57 20.32,4.57 21.08,5.33 21.08,6.35 21.84,7.11 22.86,7.11 25.4,9.65
MISO  (via drill 0.33)
  Top 0.152: v19.05,29.21 19.56,28.7 19.56,27.43 IC3.11 | v5.33,15.75 5.33,12.7 9.91,8.13 12.45,8.13 15.75,4.83 15.75,4.32 v16,4.06 | ISP.1 39.62,5.08 v29.46,15.24
  Bottom 0.152: v19.05,29.21 18.29,29.21 9.65,20.57 9.65,20.07 v5.33,15.75 | v16,4.06 16,6.35 16.76,7.11 19.05,7.11 19.3,7.37 21.08,7.37 29.21,15.49 | 29.21,15.49 34.54,20.83 35.05,20.83 35.31,21.08 MICROSD.7 | 29.21,15.49 v29.46,15.24
MOSI  (via drill 0.33)
  Top 0.152: v38.35,20.07 29.21,29.21 28.7,29.21 28.45,29.46 26.92,29.46 25.91,30.48 24.13,28.7 22.1,28.7 20.32,26.92 IC3.10 | ISP.4 43.69,3.56 42.67,4.57 42.67,7.11 v34.04,15.75
  Bottom 0.152: v38.35,20.07 38.35,19.05 36.32,17.02 35.81,17.02 35.56,16.76 MICROSD.3 35.31,16.51 35.05,16.26 34.54,16.26 v34.04,15.75
N$1
  Top 0.152: 5.59,18.8 3.3,16.51 IC4.3 | 5.59,18.8 2.03,22.35 SWITCH.3 | 5.59,18.8 7.87,16.51 8.38,16.51 9.14,15.75 9.14,15.49 C2.1
N$2
  Top 0.152: C7.1 7.11,19.3 7.11,21.84 7.62,22.35 X3.P$1 7.62,22.61 3.05,27.18 3.05,28.45 5.33,30.73 7.37,30.73 7.62,30.48 7.62,28.96 11.18,25.4 13.97,25.4 14.22,25.15 14.73,25.15 IC3.16
N$3
  Top 0.152: C6.1 6.86,29.72 6.86,27.18 7.62,26.42 X3.P$2 7.62,26.16 8.89,24.89 13.46,24.89 13.72,24.64 13.97,24.64 IC3.17
N$4  (via drill 0.33)
  Top 0.152: v13.46,43.69 12.7,42.93 WS10.I | v14.48,46.99 14.99,46.99 15.49,46.48 WS9.O
  Bottom 0.152: v13.46,43.69 13.46,45.97 v14.48,46.99
N$5  (via drill 0.33)
  Top 0.152: v27.69,23.11 26.92,23.11 25.65,24.38 25.65,25.15 IC2.1 | v47.75,60.96 48.51,61.72 48.26,61.98 PWR.C
  Bottom 0.152: v27.69,23.11 27.69,23.37 28.96,24.64 28.96,25.91 31.5,28.45 31.5,29.46 35.31,33.27 35.31,34.54 43.18,42.42 43.18,54.1 45.47,56.39 45.47,58.67 v47.75,60.96
N$6  (via drill 0.33)
  Top 0.152: v26.42,27.94 25.65,27.94 IC2.5 | v9.65,28.45 9.65,31.5 8.89,32.26 RC.2
  Bottom 0.152: v26.42,27.94 25.4,27.94 20.07,22.61 20.07,22.1 10.92,12.95 10.67,12.95 3.81,6.1 2.79,6.1 0.51,8.38 0.51,14.99 4.06,18.54 4.06,22.86 v9.65,28.45
N$7
  Top 0.152: Q4.3 41.66,62.74 U$1.-
N$8  (via drill 0.33)
  Top 0.152: IR10.C 16.26,38.1 14.22,40.13 14.22,44.96 IR9.C 13.97,44.96 13.72,45.21 v14.48,45.97 | v16,50.8 16,52.32 IR8.C | v21.34,56.9 21.59,56.64 22.35,56.64 IR7.C | v27.18,30.23 23.88,33.53 22.35,33.53 IR1.C | v30.99,33.02 30.73,33.02 29.97,33.78 IR2.C | Q1.3 22.61,62.48 v24.64,60.45 27.18,57.91 27.94,57.91 28.96,56.9 29.72,56.9 29.97,56.64 IR6.C 30.23,56.64 31.5,56.64 35.81,52.32 IR5.C 36.07,52.07 37.85,50.29 37.85,44.96 IR4.C 38.1,44.96 38.61,44.45 38.61,41.91 39.12,41.4 35.81,38.1 IR3.C 35.56,37.85 36.07,37.34 v35.05,36.32
  Bottom 0.152: v14.48,45.97 16,47.5 v16,50.8 20.57,55.37 20.57,56.13 v21.34,56.9 21.34,57.15 v24.64,60.45 | v27.18,30.23 28.19,30.23 v30.99,33.02 31.75,33.02 v35.05,36.32
N$10
  Top 0.152: PWR.A 46.99,63.25 46.99,59.94 43.18,56.13 44.96,54.36 RE1.1
N$11
  Top 0.152: IR1.A 22.1,32.26 22.1,29.97 IRR1.1
N$12
  Top 0.152: NKA.7 19.81,5.84 20.32,5.84 21.84,4.32 33.27,4.32 35.05,2.54 NKA1.1
N$13  (via drill 0.33)
  Top 0.152: v31.24,32 30.99,32.26 30.23,32.26 IR2.A | v28.96,29.97 30.23,29.97 IRR2.1
  Bottom 0.152: v31.24,32 30.99,32 v28.96,29.97
N$14  (via drill 0.33)
  Top 0.152: v31.24,55.88 31.5,55.63 30.73,54.86 WS6.O | v29.72,58.93 28.19,58.93 WS7.I
  Bottom 0.152: v31.24,55.88 28.96,58.17 v29.72,58.93
N$15
  Top 0.152: IR3.A 37.08,37.08 37.08,36.58 38.35,35.31 IRR3.1
N$16
  Top 0.152: IR6.A 30.48,57.66 30.99,57.66 32.51,56.13 33.02,56.13 33.53,55.63 34.29,55.63 35.05,56.39 32,59.44 IRR6.1
N$17
  Top 0.152: IR4.A 40.64,44.96 41.91,46.23 IRR4.1
N$18
  Top 0.152: IR5.A 37.34,53.09 38.86,54.61 38.35,55.12 IRR5.1
N$19  (via drill 0.33)
  Top 0.152: v37.85,43.94 36.83,43.94 WS4.O | v38.86,46.48 39.62,47.24 WS5.I
  Bottom 0.152: v37.85,43.94 37.85,45.47 v38.86,46.48
N$20  (via drill 0.33)
  Top 0.152: v34.04,50.8 34.54,50.29 35.31,50.29 WS5.O | v35.05,54.1 35.81,54.86 WS6.I
  Bottom 0.152: v34.04,50.8 34.04,53.09 v35.05,54.1
N$21  (via drill 0.33)
  Top 0.152: v24.64,25.91 23.88,25.15 23.88,24.64 24.38,24.13 23.62,23.37 IC3.4 | v34.04,33.53 35.56,33.53 37.34,31.75 RD+1.2
  Bottom 0.152: v24.64,25.91 26.42,25.91 v34.04,33.53
N$22  (via drill 0.33)
  Top 0.152: v26.67,21.59 25.15,23.11 24.89,23.11 24.64,23.37 24.13,22.86 IC3.3 | v36.83,29.21 38.1,29.21 39.37,27.94 RD-1.2
  Bottom 0.152: v26.67,21.59 29.21,21.59 v36.83,29.21
N$23
  Top 0.152: WS1.O 21.59,35.31 20.57,34.29 21.84,33.02 22.35,33.02 24.13,31.24 WS2.I
N$24  (via drill 0.33)
  Top 0.152: v29.21,32.77 28.19,33.78 28.19,34.54 WS2.O | v30.99,34.04 31.24,34.04 32.51,32.77 WS3.I
  Bottom 0.152: v29.21,32.77 29.72,32.77 v30.99,34.04
N$25  (via drill 0.33)
  Top 0.152: v35.05,37.34 34.54,37.85 34.04,37.85 WS3.O | v37.34,38.61 38.1,39.37 38.35,39.12 WS4.I
  Bottom 0.152: v35.05,37.34 36.07,37.34 v37.34,38.61
N$26
  Top 0.152: IR7.A 22.1,57.91 20.57,59.44 IRR7.1
N$27
  Top 0.152: WS9.I 13.97,51.31 16.51,53.85 18.29,52.07 WS8.O
N$28  (via drill 0.33)
  Top 0.152: v21.34,55.88 19.81,57.4 WS8.I | v23.11,57.4 23.11,56.9 24.38,55.63 WS7.O
  Bottom 0.152: v21.34,55.88 21.59,55.88 v23.11,57.4
N$29
  Top 0.152: IR8.A 14.73,53.34 13.21,53.34 IRR8.1
N$30
  Top 0.152: IR9.A 11.43,44.96 10.67,44.2 IRR9.1
N$31
  Top 0.152: T1.1 21.59,10.67 21.59,6.6 22.35,5.84 NKA.6
  Bottom 0.152: NKA1.7 19.81,3.05 22.35,5.59 NKA.6
N$32
  Top 0.152: IR10.A 14.99,37.08 13.46,35.56 13.97,35.05 IRR10.1
RESET  (via drill 0.33)
  Top 0.152: v20.83,22.35 16.51,26.67 IC3.13 | v10.92,12.19 10.92,10.16 RST.B' | ISP.5 45.72,5.08 34.29,16.51 33.53,16.51 31.24,18.8 30.73,18.8 v24.64,24.89 | v10.92,7.37 10.92,3.3 RST.B
  Bottom 0.152: v24.64,24.89 23.37,24.89 v20.83,22.35 20.83,22.1 v10.92,12.19 v10.92,7.37
RX
  Top 0.152: JP2.7 2.03,54.61 2.03,55.37 0.76,56.64 0.76,57.66 1.52,58.42 1.78,58.17 5.33,58.17 6.1,57.4 6.1,56.64 12.7,50.04 13.21,50.04 13.46,49.78 14.48,49.78 17.02,47.24 17.02,46.74 22.35,41.4 22.35,39.62 23.62,38.35 JP5.4 23.62,38.1 25.65,36.07 27.43,37.85 27.43,38.86 28.45,39.88 28.45,40.64 JP1.4
SCK  (via drill 0.33)
  Top 0.152: v25.4,26.67 23.88,28.19 22.86,28.19 20.83,26.16 IC3.9 | v28.19,28.7 28.19,28.45 v36.83,19.81 47.24,9.4 v47.24,8.64
  Bottom 0.152: v25.4,26.67 26.16,26.67 v28.19,28.7 | v36.83,19.81 36.32,19.3 35.81,19.3 35.56,19.05 MICROSD.5 | v47.24,8.64 ISP.3
SCL  (via drill 0.33)
  Top 0.152: v14.99,22.86 14.22,23.62 13.72,23.62 IC3.18 | 24.13,41.4 25.65,42.93 27.43,42.93 27.69,42.67 28.45,42.67 29.97,41.15 29.97,40.39 28.19,38.61 28.7,38.1 JP5.2 | 24.13,41.4 23.62,40.89 JP1.2 24.13,41.4 | RSCL.1 6.35,64.77 6.35,61.98 5.08,60.71 3.3,60.71 2.29,59.69 JP2.3 | v30.73,64.26 34.04,64.26 EEPRM.6 | v19.56,45.97 24.13,41.4
  Bottom 0.152: v14.99,22.86 19.56,27.43 19.56,28.7 28.7,37.85 JP5.2 | 29.46,64.26 21.08,64.26 17.78,67.56 11.94,67.56 5.08,60.71 3.3,60.71 2.29,59.69 JP2.3 | 29.46,64.26 v30.73,64.26 | v19.56,45.97 19.56,52.83 23.88,57.15 23.88,58.67 29.46,64.26
SDA  (via drill 0.33)
  Top 0.152: v11.94,24.13 12.7,23.37 12.95,23.37 IC3.19 | RSDA.1 8.89,66.8 9.91,65.79 v9.91,62.99 11.18,61.72 12.7,61.72 21.08,53.34 22.1,53.34 23.37,52.07 23.88,52.07 25.4,50.55 31.75,50.55 v34.54,47.75 | v40.39,54.61 34.29,60.71 34.29,62.74 EEPRM.5 | JP5.3 26.16,40.89 JP1.3
  Bottom 0.152: v11.94,24.13 26.16,38.35 JP5.3 | v9.91,62.99 5.08,58.17 3.3,58.17 2.29,57.15 JP2.5 | v40.39,54.61 40.39,53.59 v34.54,47.75 31.75,44.96 30.48,44.96 28.19,42.67 27.69,42.67 26.16,41.15 JP1.3
TX  (via drill 0.33)
  Top 0.152: v10.16,42.93 2.29,50.8 2.29,51.82 JP2.9 | v17.02,43.43 17.02,42.67 21.08,38.61 JP5.5 21.08,38.35 23.88,35.56 25.4,35.56 25.65,35.31 26.42,36.07 28.45,36.07 29.97,37.59 29.97,38.86 29.46,39.37 30.99,40.89 JP1.5
  Bottom 0.152: v10.16,42.93 16.51,42.93 v17.02,43.43
VBAT  (via drill 0.33)
  Top 0.152: v6.6,40.89 7.62,39.88 USB.1 7.87,39.88 2.54,45.21 2.29,45.21 JP4.2 | v37.85,14.22 27.43,24.64 27.43,25.15 IC2.3 | 48.26,17.78 49.02,18.54 BAT1.P$2 | 48.26,17.78 v47.75,17.27 | v46.23,42.16 46.23,36.32 48.26,34.29 48.26,28.45 42.93,23.11 48.26,17.78
  Bottom 0.152: SWITCH.2 5.33,28.7 5.33,34.04 | 5.33,34.04 5.33,39.62 v6.6,40.89 | v37.85,14.22 44.7,14.22 v47.75,17.27 | 5.33,34.04 10.67,34.04 22.35,45.72 22.35,46.74 23.11,47.5 24.13,47.5 24.89,48.26 24.89,49.53 25.65,50.29 26.67,50.29 42.67,66.29 43.43,66.29 48.77,60.96 48.01,60.2 47.5,60.2 46.23,58.93 v46.23,42.16
VBUS  (via drill 0.33)
  Top 0.152: 47.24,7.62 47.5,7.37 47.5,2.29 45.72,0.51 43.18,0.51 ISP.2 | 47.24,7.62 28.19,26.67 | 28.19,26.67 27.43,27.43 27.43,27.94 IC2.4 27.18,28.19 v26.16,29.21 | v22.61,26.16 22.61,25.91 21.84,25.15 IC3.7 | 47.24,7.62 48.01,8.38 48.01,9.14 46.99,10.16 46.99,14.22 33.78,27.43 36.32,29.97 44.2,29.97 X2.VBUS | v23.62,66.8 23.88,66.55 25.91,66.55 C1.1 | v44.7,56.64 46.74,54.61 46.74,54.36 RE1.2 | JP3.1 21.08,48.77 21.84,48.77 23.11,47.5 25.4,47.5 25.65,47.75 27.94,47.75 28.19,47.5 30.23,47.5 31.24,46.48 JP6.1 | v28.45,26.92 28.19,26.67
  Bottom 0.152: v22.61,26.16 23.11,26.16 v26.16,29.21 | 20.83,66.8 19.05,66.8 17.78,68.07 10.67,68.07 4.83,62.23 JP2.2 | 20.83,66.8 v23.62,66.8 | 44.45,56.64 41.4,56.64 31.24,46.48 JP6.1 | 20.83,66.8 20.83,65.79 21.84,64.77 30.23,64.77 30.48,65.02 31.24,65.02 32,64.26 27.94,60.2 27.94,58.17 22.86,53.09 22.86,50.8 JP3.1 | v28.45,26.92 34.8,33.27 34.8,35.05 38.1,38.35 38.1,42.67 34.29,46.48 44.45,56.64 | 44.45,56.64 v44.7,56.64
VCC  (via drill 0.33)
  Top 0.152: IRR5.2 39.37,53.34 37.85,51.82 38.35,51.31 WS5.D 38.61,51.05 40.64,49.02 42.93,49.02 RU1.2 42.93,45.21 41.91,44.2 | WS2.D 28.19,31.24 30.73,31.24 31.24,30.73 32,30.73 IRR2.2 32.26,30.73 38.35,30.73 38.35,34.04 | 39.88,42.67 39.88,37.08 IRR3.2 39.62,36.83 40.64,35.81 38.86,34.04 38.35,34.04 | 41.91,44.2 40.13,42.42 39.88,42.67 | 39.88,42.67 WS4.D | 38.35,34.04 37.34,35.05 36.07,35.05 WS3.D 35.81,35.31 34.54,35.31 32.51,37.34 32.51,41.4 31.75,42.16 31.24,42.16 30.48,42.93 29.97,42.93 28.19,44.7 27.69,44.7 26.16,46.23 JP6.3 | 41.91,44.2 IRR4.2 | WS7.D 24.13,58.93 22.86,60.2 22.35,60.2 IRR7.2 22.1,60.45 20.57,61.98 20.57,64.01 19.3,65.28 19.81,65.79 | 19.81,65.79 21.84,67.82 23.62,67.82 24.13,67.31 30.23,67.31 30.73,66.8 34.04,66.8 EEPRM.8 | 12.19,47.75 11.43,46.99 | 11.43,46.99 10.67,46.23 IRR9.2 | 12.19,47.75 12.45,47.5 WS9.D 12.19,47.75 | 12.19,47.75 12.19,49.53 4.83,56.9 JP2.6 | IRR6.2 30.23,60.2 30.23,59.44 30.99,58.67 31.5,58.67 32.51,57.66 WS6.D 32.77,57.4 v33.78,56.39 | 6.86,66.8 7.11,66.8 8.64,65.28 RSDA.2 8.89,65.02 v8.89,60.71 14.22,55.37 IRR8.2 14.48,55.12 16.26,55.12 WS8.D 16.51,54.86 19.05,54.86 21.08,52.83 22.1,52.83 25.91,49.02 JP3.3 | 6.86,66.8 6.6,66.8 RSCL.2 6.86,66.8 | v42.93,65.53 U$1.+ | 19.81,65.79 19.56,65.79 18.29,67.06 10.67,67.06 9.65,68.07 8.13,68.07 6.86,66.8 | 23.88,9.91 24.89,10.92 25.15,10.67 T2.2 25.4,10.67 v26.16,9.91 | 23.88,9.91 22.61,8.64 T1.2 | 23.88,9.91 20.83,12.95 20.32,12.95 20.07,13.21 19.81,13.21 IC3.34 | IC4.2 4.06,13.97 2.29,12.19 3.3,11.18 THM1.2 3.3,10.92 7.11,7.11 7.11,5.08 7.62,4.57 7.62,2.79 C9.1
  Top 0.152: v10.92,17.53 11.68,18.29 IC3.24 | 14.48,38.35 12.95,36.83 IRR10.2 12.7,36.83 11.94,36.83 10.16,38.61 5.33,38.61 4.57,37.85 5.59,36.83 7.37,36.83 12.95,31.24 13.21,31.24 13.46,30.99 13.46,27.18 | 14.48,38.35 13.97,38.86 WS10.D | 19.05,33.02 17.78,31.75 C4.1 | 19.05,33.02 19.56,32.51 WS1.D | IRR1.2 20.32,30.73 20.32,32 19.81,32.51 WS1.D | 14.48,38.35 14.99,38.35 18.03,35.31 18.03,34.04 19.05,33.02 | 14.48,38.35 WS10.D | 19.05,33.02 WS1.D | 13.46,27.18 12.19,28.45 C3.1 | 13.46,27.18 13.97,26.67 14.99,26.67 15.49,26.16 15.75,26.16 IC3.14 16,25.91 16.26,25.91 v17.78,24.38 22.35,19.81 | 22.35,19.81 22.35,20.07 23.11,20.83 25.15,18.8 IC3.44 25.15,19.05 21.08,23.11 IC3.6 | 22.35,19.81 22.35,19.56 23.88,18.03 IC3.42 24.13,17.78 28.96,12.95 v29.21,12.95 | 11.43,46.99 5.33,53.09 1.52,53.09 0.51,52.07 0.51,51.56 9.91,42.16 10.67,42.16 13.72,39.12 WS10.D
  Bottom 0.152: v42.93,65.53 42.67,65.53 33.53,56.39 | 33.53,56.39 JP3.3 26.16,48.77 JP6.3 | 33.53,56.39 v33.78,56.39 | v8.89,60.71 5.33,57.15 4.83,57.15 JP2.6 | 27.69,11.43 28.96,10.16 29.46,10.16 29.72,10.41 34.04,10.41 36.32,12.7 46.48,12.7 46.74,12.95 50.8,8.89 50.8,7.87 RSD.2 | 27.69,11.43 28.96,12.7 29.21,12.7 | 29.21,12.7 29.72,12.7 34.54,17.53 35.05,17.53 35.31,17.78 MICROSD.4 | 27.69,11.43 v26.16,9.91 | THM1.2 3.3,11.18 9.65,17.53 v10.92,17.53 v17.78,24.38 | v29.21,12.95 29.21,12.7

### Text on the board
tNames: PUBLIC | ***** | LAB | OPEN- | LUX | **** | REV-Q | VBUS | GND | A0 | A1 | VCC | GND | VBAT | A2 | SCL | SDA | RX | TX | USB
bNames: Hardware License | A2 | GND | A1 | VCC | CERN Open | Ver. 1.1 | A0 | VBUS | TX | SCL | RX | SDA | A1 | A0 | VCC | VBUS | GND | TX | RX | SDA | SCL | A2 | PUBLICLAB.ORG/WIKI/OPEN-LUX | SCK | GND | LED | LCD | D8 | D9 | A3 | GND | A4 | GND | LCD | D8 | D9 | A3 | GND | A4 | LED | MISO | VBUS | MOSI | RST | MISO | GND